# Altium project mt3608.PrjPcb
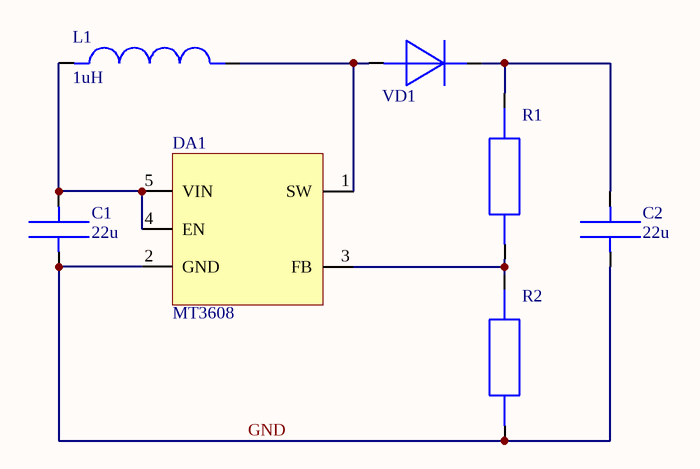
[diagram p0: mt3608.SchDoc]
1 sheet, 7 parts. Net scope: global (net labels, ports and power ports of the same name join across sheets).
Board file: mt3608.PcbDoc

## Sheet mt3608.SchDoc
size A2

### Parts
C1  22u  [C1206]
C2  22u  [C1206]
DA1  MT3608  [SOT23-6]
L1  1uH  [L_CDRH104R]
R1  (no value)  [R0805]
R2  (no value)  [R0805]
VD1  VD_SMB  [SMB]  (value not drawn)

### Nets
GND: C1.1 C2.1 DA1.2(GND) R2.1
NetC1_2: C1.2 DA1.4(EN) DA1.5(VIN) L1.1
NetC2_2: C2.2 R1.2 VD1.2
NetDA1_1: DA1.1(SW) L1.2 VD1.1
NetDA1_3: DA1.3(FB) R1.1 R2.2

### Library data of the parts
C1 C2 = C1210
L1 = L_CDRH104R
R1 R2 = R0805